# EAGLE design mercedes_shield_v2_gp (EAGLE 5.11)
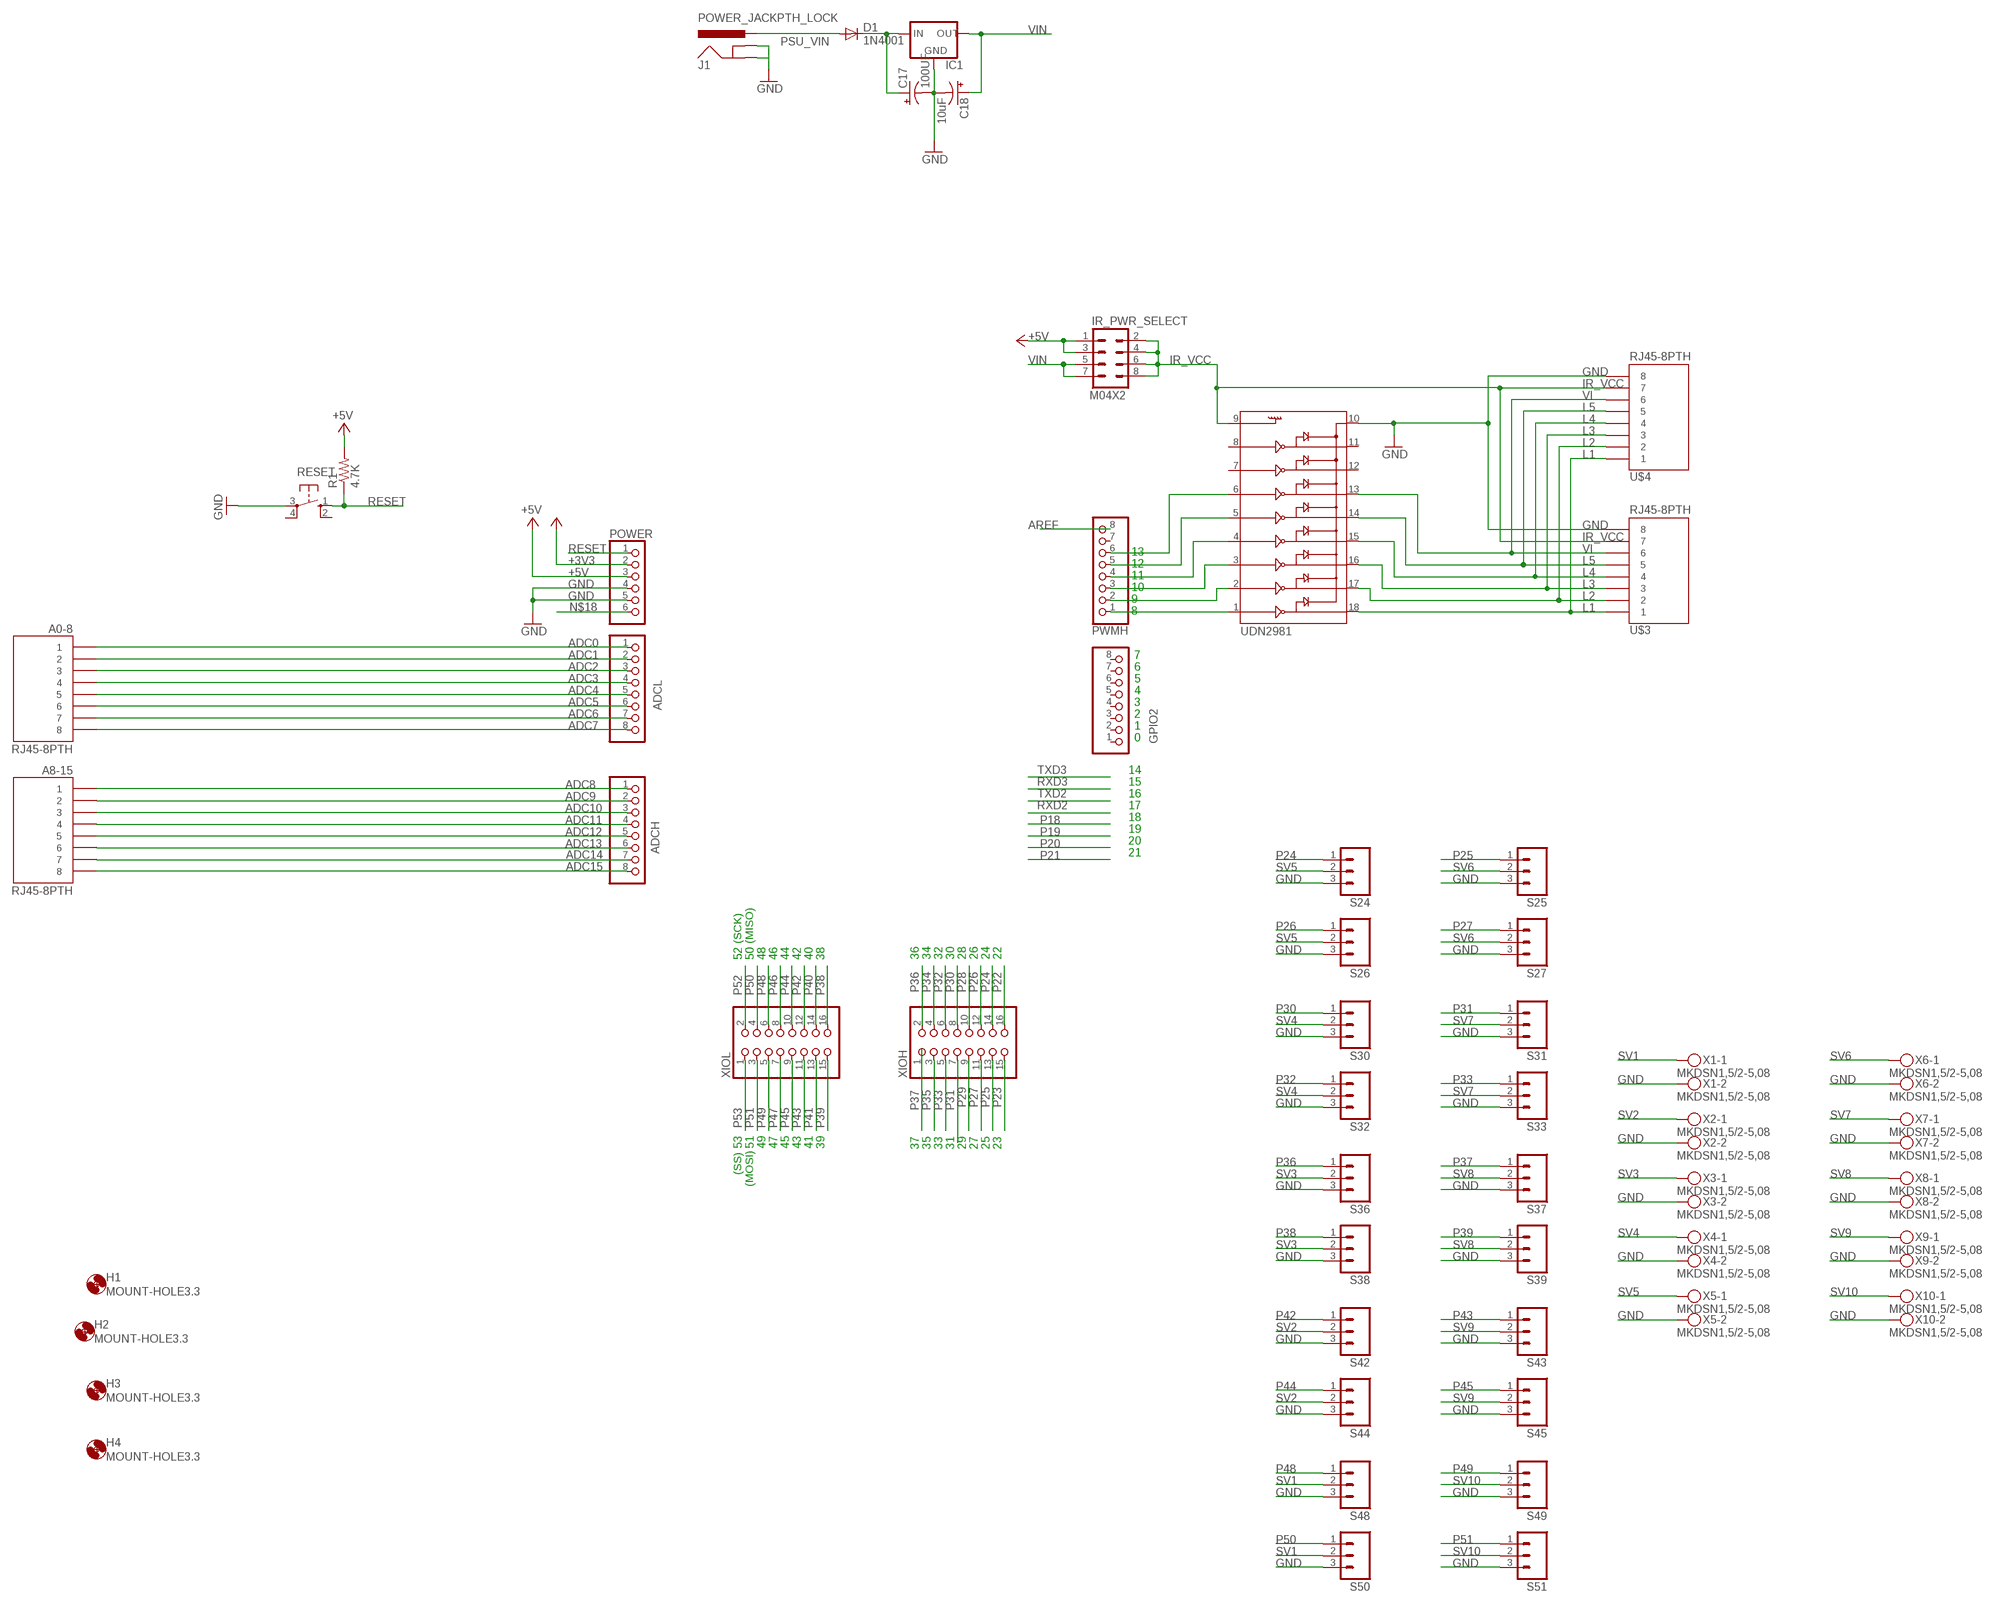
[diagram p0: schematic, sheet 1]

## Parts
A0-8  RJ45-8PTH  [RJ45-8]
A8-15  RJ45-8PTH  [RJ45-8]
ADCH  PINHD-1X8  [1X08]
ADCL  PINHD-1X8  [1X08]
C17  100UF  CAP_POLPTH1  [CPOL-RADIAL-100UF-25V]
C18  10uF  CAP_POLPTH2  [CPOL-RADIAL-10UF-25V]
D1  1N4001  DIODESMA  [SMA-DIODE]
GPIO2  PINHD-1X8  [1X08]
H1  MOUNT-HOLE3.3  [3,3]
H2  MOUNT-HOLE3.3  [3,3]
H3  MOUNT-HOLE3.3  [3,3]
H4  MOUNT-HOLE3.3  [3,3]
IC1  V_REG_78XXSINK  [TO220-IGO]
IR_PWR_SELECT  M04X2  [2X4]
J1  POWER_JACKPTH_LOCK  [POWER_JACK_PTH_LOCK]
POWER  PINHD-1X6  [1X06]
PWMH  PINHD-1X8  [1X08]
R1  4.7K  RESISTORPTH-1/4W  [AXIAL-0.4]
RESET  10-XX  [B3F-10XX]
S24  M03PTH  [1X03]
S25  M03PTH  [1X03]
S26  M03PTH  [1X03]
S27  M03PTH  [1X03]
S30  M03PTH  [1X03]
S31  M03PTH  [1X03]
S32  M03PTH  [1X03]
S33  M03PTH  [1X03]
S36  M03PTH  [1X03]
S37  M03PTH  [1X03]
S38  M03PTH  [1X03]
S39  M03PTH  [1X03]
S42  M03PTH  [1X03]
S43  M03PTH  [1X03]
S44  M03PTH  [1X03]
S45  M03PTH  [1X03]
S48  M03PTH  [1X03]
S49  M03PTH  [1X03]
S50  M03PTH  [1X03]
S51  M03PTH  [1X03]
U$3  RJ45-8PTH  [RJ45-8]
U$4  RJ45-8PTH  [RJ45-8]
UDN2981  ULN2803DIP  [DIL18]
X1  MKDSN1,5/2-5,08  [MKDSN1,5/2-5,08]
X2  MKDSN1,5/2-5,08  [MKDSN1,5/2-5,08]
X3  MKDSN1,5/2-5,08  [MKDSN1,5/2-5,08]
X4  MKDSN1,5/2-5,08  [MKDSN1,5/2-5,08]
X5  MKDSN1,5/2-5,08  [MKDSN1,5/2-5,08]
X6  MKDSN1,5/2-5,08  [MKDSN1,5/2-5,08]
X7  MKDSN1,5/2-5,08  [MKDSN1,5/2-5,08]
X8  MKDSN1,5/2-5,08  [MKDSN1,5/2-5,08]
X9  MKDSN1,5/2-5,08  [MKDSN1,5/2-5,08]
X10  MKDSN1,5/2-5,08  [MKDSN1,5/2-5,08]
XIOH  PINHD-2X8  [2X08]
XIOL  PINHD-2X8  [2X08]

## Nets
+3V3: POWER.2
+5V: IR_PWR_SELECT.1 IR_PWR_SELECT.3 POWER.3 R1.P$2
ADC0: A0-8.1 ADCL.1
ADC1: A0-8.2 ADCL.2
ADC2: A0-8.3 ADCL.3
ADC3: A0-8.4 ADCL.4
ADC4: A0-8.5 ADCL.5
ADC5: A0-8.6 ADCL.6
ADC6: A0-8.7 ADCL.7
ADC7: A0-8.8 ADCL.8
ADC8: A8-15.1 ADCH.1
ADC9: A8-15.2 ADCH.2
ADC10: A8-15.3 ADCH.3
ADC11: A8-15.4 ADCH.4
ADC12: A8-15.5 ADCH.5
ADC13: A8-15.6 ADCH.6
ADC14: A8-15.7 ADCH.7
ADC15: A8-15.8 ADCH.8
AREF: PWMH.8
GND: C17.2(-) C18.2(-) IC1.GND J1.GND J1.GNDBREAK POWER.4 POWER.5 RESET.3(P) S24.3 S25.3 S26.3 S27.3 S30.3 S31.3 S32.3 S33.3 S36.3 S37.3 S38.3 S39.3 S42.3 S43.3 S44.3 S45.3 S48.3 S49.3 S50.3 S51.3 U$3.8 U$4.8 UDN2981.10 X1.2 X2.2 X3.2 X4.2 X5.2 X6.2 X7.2 X8.2 X9.2 X10.2
IR_VCC: IR_PWR_SELECT.2 IR_PWR_SELECT.4 IR_PWR_SELECT.6 IR_PWR_SELECT.8 U$3.7 U$4.7 UDN2981.9
L1: U$3.1 U$4.1 UDN2981.18
L2: U$3.2 U$4.2 UDN2981.17
L3: U$3.3 U$4.3 UDN2981.16
L4: U$3.4 U$4.4 UDN2981.15
L5: U$3.5 U$4.5 UDN2981.14
N$1: PWMH.1 UDN2981.1
N$2: PWMH.2 UDN2981.2
N$3: PWMH.3 UDN2981.3
N$4: PWMH.4 UDN2981.4
N$5: PWMH.5 UDN2981.5
N$6: PWMH.6 UDN2981.6
N$10: C17.1(+) D1.C IC1.IN
N$18: POWER.6
P22: XIOH.16
P23: XIOH.15
P24: S24.1 XIOH.14
P25: S25.1 XIOH.13
P26: S26.1 XIOH.12
P27: S27.1 XIOH.11
P28: XIOH.10
P29: XIOH.9
P30: S30.1 XIOH.8
P31: S31.1 XIOH.7
P32: S32.1 XIOH.6
P33: S33.1 XIOH.5
P34: XIOH.4
P35: XIOH.3
P36: S36.1 XIOH.2
P37: S37.1 XIOH.1
P38: S38.1 XIOL.16
P39: S39.1 XIOL.15
P40: XIOL.14
P41: XIOL.13
P42: S42.1 XIOL.12
P43: S43.1 XIOL.11
P44: S44.1 XIOL.10
P45: S45.1 XIOL.9
P46: XIOL.8
P47: XIOL.7
P48: S48.1 XIOL.6
P49: S49.1 XIOL.5
P50: S50.1 XIOL.4
P51: S51.1 XIOL.3
P52: XIOL.2
P53: XIOL.1
PSU_VIN: D1.A J1.PWR
RESET: POWER.1 R1.P$1 RESET.1(S)
SV1: S48.2 S50.2 X1.1
SV2: S42.2 S44.2 X2.1
SV3: S36.2 S38.2 X3.1
SV4: S30.2 S32.2 X4.1
SV5: S24.2 S26.2 X5.1
SV6: S25.2 S27.2 X6.1
SV7: S31.2 S33.2 X7.1
SV8: S37.2 S39.2 X8.1
SV9: S43.2 S45.2 X9.1
SV10: S49.2 S51.2 X10.1
VI: U$3.6 U$4.6 UDN2981.13
VIN: C18.1(+) IC1.OUT IR_PWR_SELECT.5 IR_PWR_SELECT.7
Unconnected: GPIO2.1 GPIO2.2 GPIO2.3 GPIO2.4 GPIO2.5 GPIO2.6 GPIO2.7 GPIO2.8 PWMH.7 RESET.2(S1) RESET.4(P1) UDN2981.7 UDN2981.8 UDN2981.11 UDN2981.12

## Notes on the sheet
- 13
- 12
- 11
- 10
- 9
- 8
- 7
- 6
- 5
- 4
- 3
- 2
- 1
- 0
- 14
- 15
- 16
- 17
- 18
- 19
- 20
- 21
- (SCK) | (MISO)
- 52 | 50 | 48 | 46 | 44 | 42 | 40 | 38 | 36 | 34 | 32 | 30 | 28 | 26 | 24 | 22
- 53 | 51 | 49 | 47 | 45 | 43 | 41 | 39 | 37 | 35 | 33 | 31 | 29 | 27 | 25 | 23
- (SS)
- (MOSI)

## Library data of the parts
A0-8 A8-15 U$3 U$4 = SparkFun:RJ45-8: RJ45 Jack Simple RJ45, 8-pin connection - connector for common Cat5, Cat5e, and Cat6 Ethernet cables. Footprint not yet proven in production. Connector sku is PRT-00643; Breakout PCB sku is BOB-00716.
ADCH ADCL GPIO2 PWMH = pinhead:PINHD-1X8: PIN HEADER
C17 C18 = SparkFun:CAP_POL: Capacitor Polarized These are standard SMD and PTH capacitors. Normally 10uF, 47uF, and 100uF in electrolytic and tantalum varieties. Always verify the external diameter of the through hole cap, it varies with capacity, voltage, and manufacturer. The EIA devices should be standard.
D1 = SparkFun:DIODE: Diode These are standard reverse protection diodes and small signal diodes. SMA package can handle up to about 1A. SOD-323 can handle about 200mA. What the SOD-323 package when ordering, there are some mfgs out there that are 5-pin packages.
H1-H4 = holes:MOUNT-HOLE: MOUNTING HOLE with drill center marker
IC1 = SparkFun:V_REG_78XX: Voltage Regulator Standard 7805 5V regulator. IGO (Input Ground Output). Spark Fun Electronics SKU : COM-00107
IR_PWR_SELECT = SparkFun:M04X2
J1 = SparkFun:POWER_JACK: Power Jack This is the standard 5.5mm barrel jack for power. The PTH is the most common, proven, reliable, footprint. All others are experimental. The Slot footprint only works if the mill layer is transmitted to the PCB fab house so be warned. Spark Fun Electronics SKU : PRT-00119. Mating wall wart : TOL-00298 (and others)
POWER = pinhead:PINHD-1X6: PIN HEADER
R1 = SparkFun:RESISTOR: Resistor Basic schematic elements and footprints for 0603, 1206, and PTH resistors.
RESET = switch-omron:10-XX: OMRON SWITCH; MPN: B3F-1000; OC_FARNELL: 176432; OC_NEWARK: 36M3542
S24-S27 S30-S33 S36-S39 S42-S45 S48-S51 = SparkFun:M03: Header 3 Standard 3-pin 0.1" header. Use with straight break away headers (SKU : PRT-00116), right angle break away headers (PRT-00553), swiss pins (PRT-00743), machine pins (PRT-00117), and female headers (PRT-00115). Molex polarized connector foot print use with SKU : PRT-08232 with associated crimp pins and housings.
UDN2981 = SparkFun:ULN2803: Darlington Driver ULN2803 Darlington array. 500mA max per channel, 8-channel package. Spark Fun Electronics SKU : COM-00312
X1-X10 = con-phoenix-508:MKDSN1,5/2-5,08: MKDSN 1,5/ 2-5,08 Printklemme Nennstrom: 13,5 A Nennspannung: 250 V Rastermaß: 5,08 mm Polzahl: 2 Anschlussart: Schraubanschluss Montage: Löten Anschlussrichtung Leiter/Platine: 0 ° Artikelnummer: 1729128 Source: http://eshop.phoenixcontact.com .. 1729128.pdf; MPN: MKDSN 1,5/2-5.08; OC_FARNELL: 1792903; OC_NEWARK: 30M2397
XIOH XIOL = pinhead:PINHD-2X8: PIN HEADER

## Net classes
0 default: width 0.152 mm, drill 0.305 mm, clearance 0.152 mm

## Board
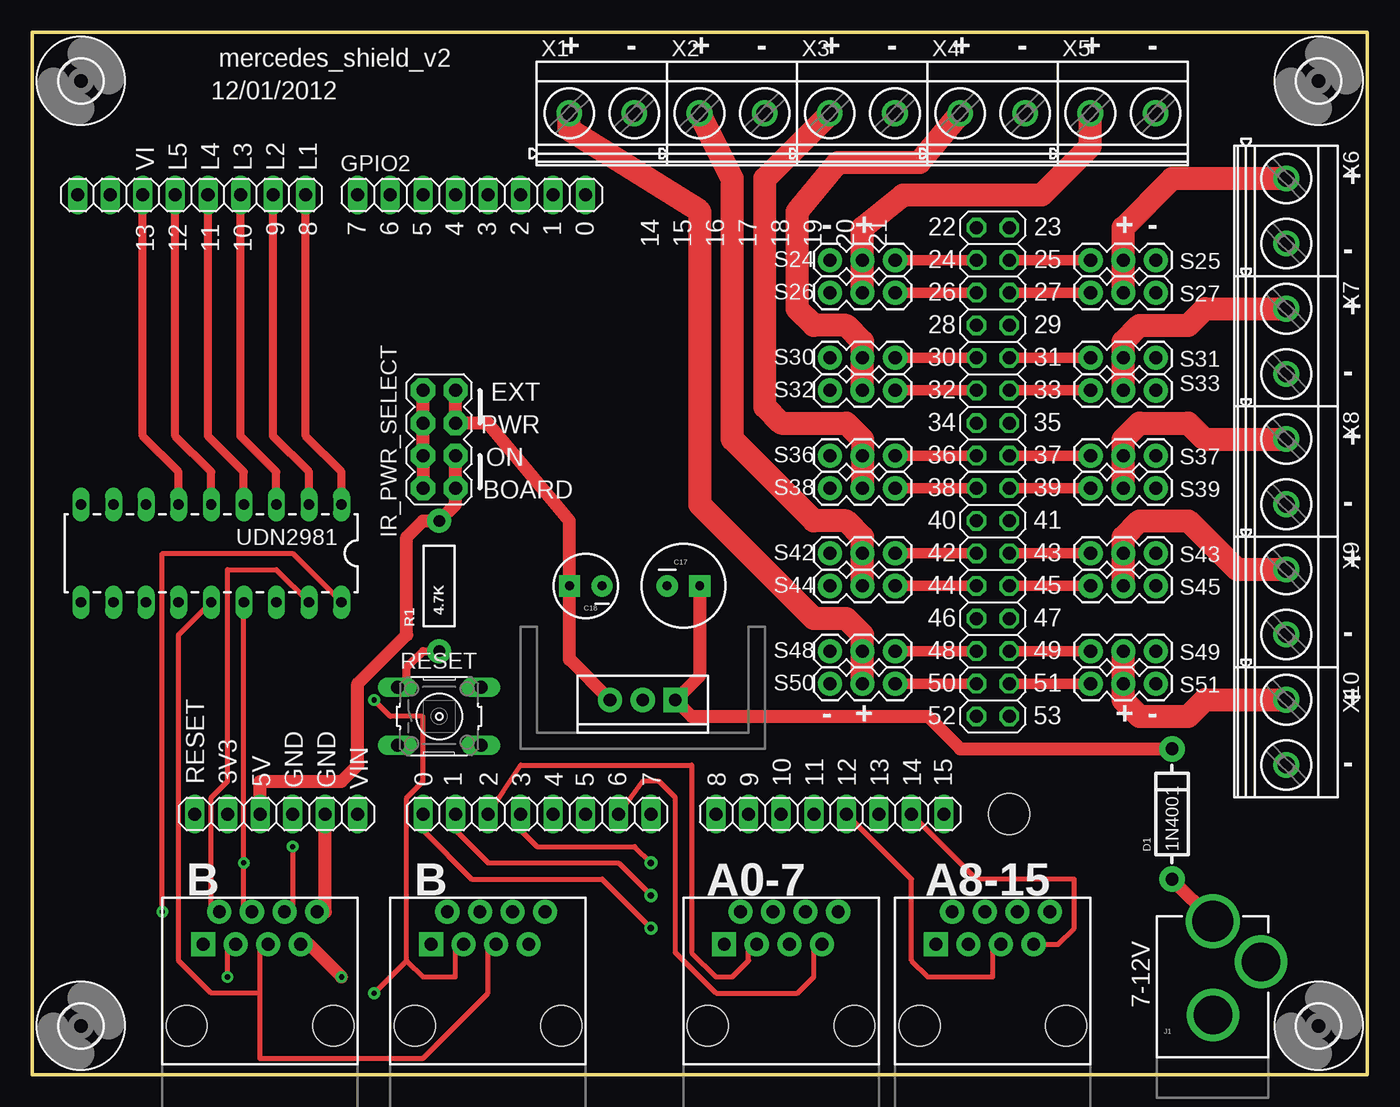
[diagram p1: board, top side]
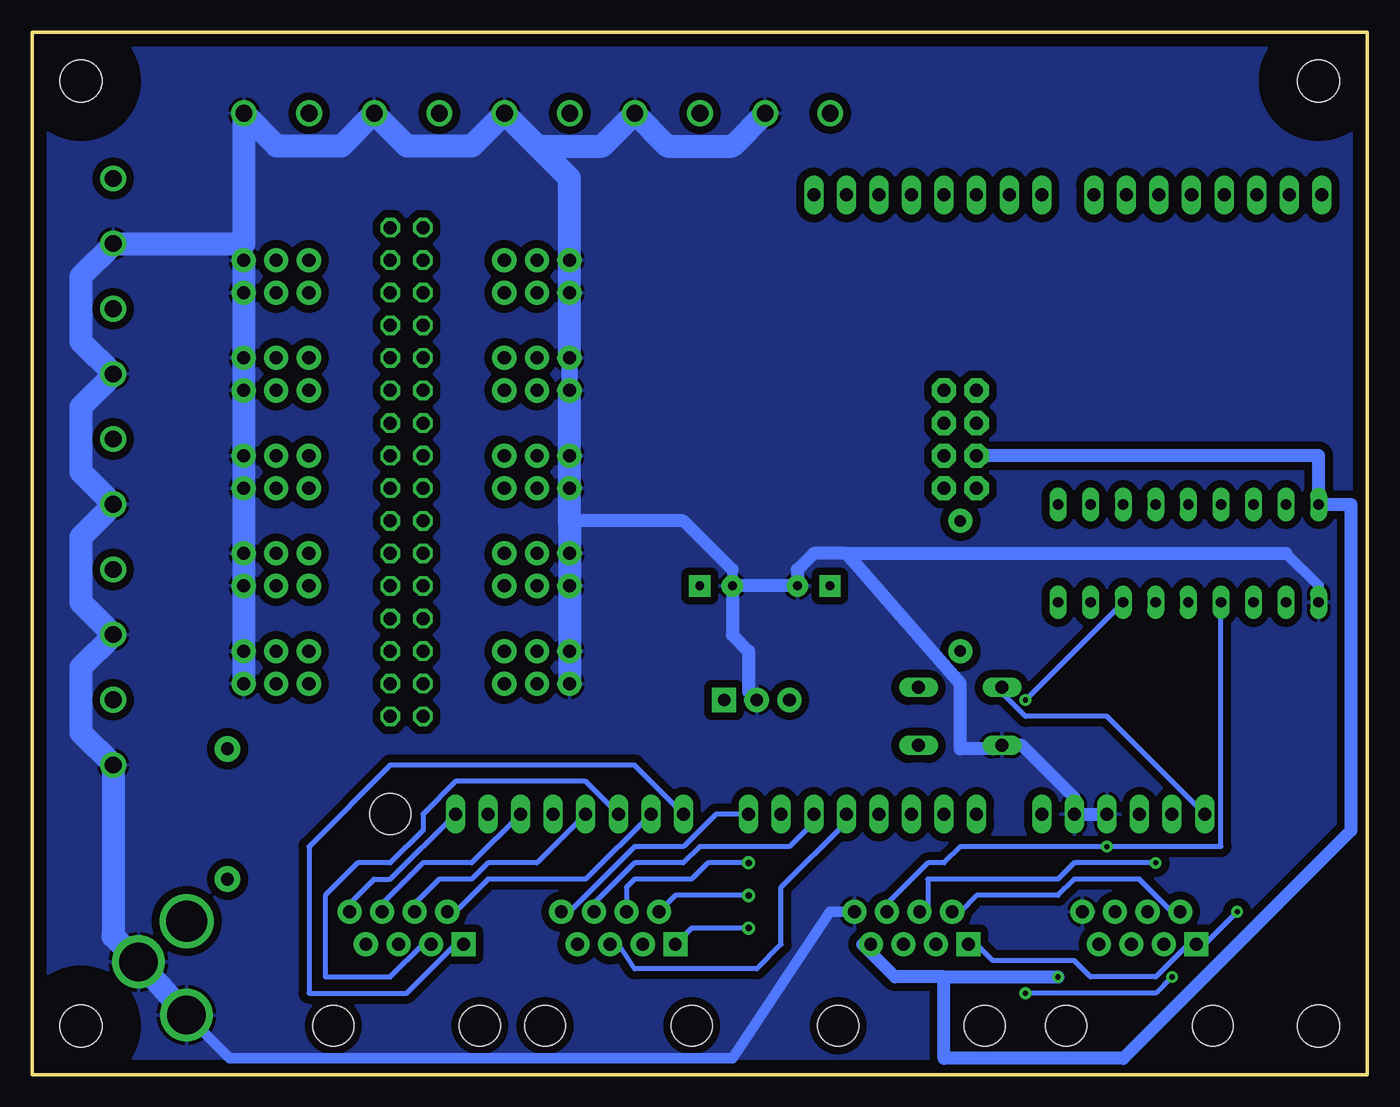
[diagram p2: board, bottom side, seen from below]

Size 104.14 x 81.28 mm. Coordinates in mm from the lower left corner, seen from the top.
Outline: 0,81.28 104.14,81.28 104.14,0 0,0 0,81.28
Copper layers (1*16): Top 0.035mm / dielectric 1.5mm / Bottom 0.035mm
Design rules "pcbtrain *": minimum track width 0.4mm, minimum drill 0.4mm, track to track 0.2mm, track to pad 0.2mm, pad to pad 0.2mm, via to via 0.2mm, smd to smd 0mil, copper to edge 10mil, drill to drill 0.2mm, minimum pad ring 10mil, minimum via ring 10mil, stop-mask expansion 0.125mm, vias tented up to drill 0mil, thermal gap 10mil
Holes 3.2 mm at 76.2,20.32

### Footprints (pad centres in the part's own frame; a part is rotated, then mirrored left to right if it is on the bottom)
RJ45-8 = drill 1 pad 1.88 square: 1 -4.445,6.35 | drill 1 pad 1.88 round: 2 -3.175,8.89; 3 -1.905,6.35; 4 -0.635,8.89; 5 0.635,6.35; 6 1.905,8.89; 7 3.175,6.35; 8 4.445,8.89 | hole 3.2: -5.715,0; 5.715,0
1X08 = drill 1.016 long: 1 -8.89,0; 2 -6.35,0; 3 -3.81,0; 4 -1.27,0; 5 1.27,0; 6 3.81,0; 7 6.35,0; 8 8.89,0
CPOL-RADIAL-100UF-25V = drill 0.7 pad 1.651 square: 1 1.27,0 | drill 0.7 pad 1.651 round: 2 -1.27,0
CPOL-RADIAL-10UF-25V = drill 0.7 pad 1.651 square: 1 1.27,0 | drill 0.7 pad 1.651 round: 2 -1.27,0
DIODE-1N4001 = drill 1 pad 1.981 round: A -5.08,0; C 5.08,0
3,3 = hole 3.3: 0,0
TO220-IGO = drill 1 pad 1.88 round: GND 0,0; OUT 2.54,0 | drill 1 pad 1.88 square: IN -2.54,0
2X4 = drill 1.016 pad 1.88 octagon: 1 -3.81,-1.27; 2 -3.81,1.27; 3 -1.27,-1.27; 4 -1.27,1.27; 5 1.27,-1.27; 6 1.27,1.27; 7 3.81,-1.27; 8 3.81,1.27
POWER_JACK_PTH_LOCK = drill 2.997 pad 4.115 round: GND 0.025,6.557; GNDBREAK 3.762,10.7 | drill 3.2 pad 4.115 round: PWR 0,13.878
1X06 = drill 1.016 long: 1 -6.35,0; 2 -3.81,0; 3 -1.27,0; 4 1.27,0; 5 3.81,0; 6 6.35,0
AXIAL-0.4 = drill 0.9 pad 1.88 round: P$1 -5.08,0; P$2 5.08,0
B3F-10XX = drill 1.016 long: 1 -3.251,2.261; 2 3.251,2.261; 3 -3.251,-2.261; 4 3.251,-2.261
1X03 = drill 1.016 pad 1.88 round: 1 0,0; 2 2.54,0; 3 5.08,0
DIL18 = drill 0.813 long: 1 -10.16,-3.81; 2 -7.62,-3.81; 3 -5.08,-3.81; 4 -2.54,-3.81; 5 0,-3.81; 6 2.54,-3.81; 7 5.08,-3.81; 8 7.62,-3.81; 9 10.16,-3.81; 10 10.16,3.81; 11 7.62,3.81; 12 5.08,3.81; 13 2.54,3.81; 14 0,3.81; 15 -2.54,3.81; 16 -5.08,3.81; 17 -7.62,3.81; 18 -10.16,3.81
MKDSN1,5/2-5,08 = drill 1.3 pad 2 round: 1 -2.561,0.025; 2 2.519,0.025
2X08 = drill 1.016 octagon: 1 -8.89,-1.27; 2 -8.89,1.27; 3 -6.35,-1.27; 4 -6.35,1.27; 5 -3.81,-1.27; 6 -3.81,1.27; 7 -1.27,-1.27; 8 -1.27,1.27; 9 1.27,-1.27; 10 1.27,1.27; 11 3.81,-1.27; 12 3.81,1.27; 13 6.35,-1.27; 14 6.35,1.27; 15 8.89,-1.27; 16 8.89,1.27

### Placement (x,y rotation side)
A0-8  58.42,3.81 0 top
A8-15  74.93,3.81 0 top
ADCH  62.23,20.32 0 top
ADCL  39.37,20.32 0 top
C17  50.8,38.1 0 top
C18  43.18,38.1 180 top
D1  1N4001  [DIODE-1N4001]  88.9,20.32 90 top
GPIO2  34.29,68.58 0 top
H1  3.81,77.47 0 top
H2  100.33,77.47 0 top
H3  100.33,3.81 0 top
H4  3.81,3.81 0 top
IC1  47.62,29.21 180 top
IR_PWR_SELECT  31.75,49.53 90 top
J1  92.08,-1.91 0 top
POWER  19.05,20.32 0 top
PWMH  12.45,68.58 180 top
R1  31.75,38.1 90 top
RESET  31.75,27.94 0 top
S24  67.31,63.5 180 top
S25  82.55,63.5 0 top
S26  67.31,60.96 180 top
S27  82.55,60.96 0 top
S30  67.31,55.88 180 top
S31  82.55,55.88 0 top
S32  67.31,53.34 180 top
S33  82.55,53.34 0 top
S36  67.31,48.26 180 top
S37  82.55,48.26 0 top
S38  67.31,45.72 180 top
S39  82.55,45.72 0 top
S42  67.31,40.64 180 top
S43  82.55,40.64 0 top
S44  67.31,38.1 180 top
S45  82.55,38.1 0 top
S48  67.31,33.02 180 top
S49  82.55,33.02 0 top
S50  67.31,30.48 180 top
S51  82.55,30.48 0 top
U$3  35.56,3.81 0 top
U$4  17.78,3.81 0 top
UDN2981  13.97,40.64 180 top
X1  44.45,74.93 0 top
X2  54.61,74.93 0 top
X3  64.77,74.93 0 top
X4  74.93,74.93 0 top
X5  85.09,74.93 0 top
X6  97.79,67.31 270 top
X7  97.79,57.15 270 top
X8  97.79,46.99 270 top
X9  97.79,36.83 270 top
X10  97.79,26.67 270 top
XIOH  74.93,57.15 90 top
XIOL  74.93,36.83 90 top

### Tracks (layer width: path | path; a pad name or v marks a point on that pad's centre or on a via)
+5V
  Top 1.016: IR_PWR_SELECT.3 IR_PWR_SELECT.1 33.02,44.45 R1.P$2 30.48,43.18 29.21,41.91 29.21,34.29 25.4,30.48 25.4,24.13 24.13,22.86 17.78,22.86 POWER.3
ADC0  (via drill 0.51)
  Top 0.406: ADCL.1 30.48,19.05 34.29,15.24 44.45,15.24 v48.26,11.43
  Bottom 0.406: v48.26,11.43 52.71,11.43 A0-8.1
ADC1  (via drill 0.51)
  Top 0.406: ADCL.2 33.02,19.05 35.56,16.51 45.72,16.51 v48.26,13.97
  Bottom 0.406: v48.26,13.97 53.98,13.97 A0-8.2
ADC2
  Top 0.4: ADCL.3 38.1,24.13 51.44,24.13 51.44,9.53 53.34,7.62 54.61,7.62 55.88,8.89 55.88,10.16 A0-8.3
ADC3  (via drill 0.51)
  Top 0.406: ADCL.4 38.1,19.05 39.37,17.78 46.99,17.78 v48.26,16.51
  Bottom 0.406: A0-8.4 57.79,14.61 57.15,15.24 52.71,15.24 51.44,16.51 v48.26,16.51
ADC4
  Bottom 0.4: ADCL.5 40.64,19.68 45.72,14.61 45.72,10.16 47.62,8.26 57.15,8.26 58.42,10.16 A0-8.5
ADC5
  Bottom 0.4: ADCL.6 43.18,19.68 45.09,17.78 52.07,17.78 53.34,16.51 57.15,16.51 60.96,12.7 A0-8.6
ADC6
  Top 0.4: ADCL.7 47.62,22.86 48.9,22.86 50.17,21.59 50.17,9.53 53.34,6.35 59.69,6.35 60.96,7.62 60.96,10.16 A0-8.7
ADC7
  Bottom 0.406: ADCL.8 50.8,20.32 53.34,17.78 57.15,17.78 62.23,12.7 A0-8.8
ADC8
  Bottom 0.4: ADCH.1 57.15,24.13 76.2,24.13 82.55,17.78 82.55,6.35 74.93,6.35 71.12,10.16 A8-15.1
ADC9
  Bottom 0.4: ADCH.2 60.96,15.24 68.58,15.24 71.12,12.7 A8-15.2
ADC10
  Bottom 0.4: ADCH.3 60.96,22.86 71.12,22.86 73.66,20.32 73.66,19.05 76.2,16.51 78.74,16.51 81.28,13.97 81.28,7.62 76.2,7.62 73.66,10.16 A8-15.3
ADC11
  Bottom 0.4: ADCH.4 64.77,16.51 68.58,16.51 69.85,15.24 72.39,15.24 74.93,12.7 A8-15.4
ADC12
  Top 0.4: ADCH.5 68.58,15.24 68.58,8.89 69.85,7.62 74.93,7.62 74.93,10.16 A8-15.5
ADC13
  Bottom 0.4: ADCH.6 69.85,16.51 73.66,16.51 77.47,12.7 A8-15.6
ADC14
  Top 0.4: ADCH.7 73.66,15.24 81.28,15.24 81.28,11.43 80.01,10.16 A8-15.7
ADC15
  Bottom 0.4: ADCH.8 76.2,15.24 77.47,15.24 80.01,12.7 A8-15.8
GND
  Top 1.016: POWER.5 22.86,12.7 U$4.8
  Bottom 0.813: C17.2 49.53,39.37 | 48.26,29.84 IC1.GND | U$3.8 41.91,12.7 49.53,1.27 88.72,1.27 J1.GND | UDN2981.10 3.81,38.1 6.35,40.64 | RESET.3 29.21,25.4
  Bottom 1.016: POWER.4 POWER.5 22.86,21.59 26.95,25.68 RESET.3 | 49.53,39.37 53.34,43.18 62.23,43.18 | 48.26,29.84 48.26,33.02 49.53,34.29 C17.2 C18.2 44.45,39.37 43.18,40.64 40.64,40.64 | 40.64,40.64 6.35,40.64 | 29.21,25.4 31.75,25.4 31.75,30.48 40.64,40.64
  Bottom 1.27: S32.3 S30.3 | S25.3 87.63,64.77 87.66,64.75 | X5.2 87.63,74.93 | 97.81,64.75 X6.2 | X7.2 97.81,54.59 | X8.2 97.81,44.42 | X9.2 97.81,34.27 | X1.2 | 54.61,72.44 54.61,72.39 | X2.2 | X3.2 | 74.93,72.39 74.93,72.44 | X4.2 | 85.09,72.39 85.09,72.44 | J1.GNDBREAK 95.91,8.87
  Bottom 1.778: S50.3 S48.3 S44.3 S42.3 62.23,43.18 S38.3 S36.3 S32.3 | S30.3 S26.3 S24.3 62.23,69.9 64.72,72.39 | S51.3 S49.3 S45.3 S43.3 S39.3 S37.3 S33.3 S31.3 S27.3 S25.3 | 87.63,74.93 87.63,64.77 | X7.2 100.33,57.15 100.33,62.23 97.81,64.75 87.66,64.75 | 97.81,54.59 100.33,52.07 100.33,46.99 X8.2 | 97.81,44.42 100.33,41.91 100.33,36.83 X9.2 | 97.81,34.27 100.33,31.75 100.33,26.67 X10.2 97.81,10.77 J1.GNDBREAK | X1.2 49.53,72.39 54.61,72.39 | X2.2 54.61,72.44 | X2.2 59.69,72.39 64.72,72.39 | 64.72,72.39 X3.2 | X3.2 69.85,72.39 74.93,72.39 | 74.93,72.44 X4.2 | X4.2 80.01,72.39 85.09,72.39 | 85.09,72.44 X5.2 | 95.91,8.87 J1.GND
  pour Bottom (isolate 0.61): 1.27,80.01 102.87,80.01 102.87,1.27 1.27,1.27
IR_VCC  (via drill 0.4)
  Top 1.016: IR_PWR_SELECT.8 IR_PWR_SELECT.6 IR_PWR_SELECT.4 IR_PWR_SELECT.2 | v24.13,7.62 21.59,10.16 U$4.7
  Bottom 1.016: IR_PWR_SELECT.4 3.81,48.26 UDN2981.9 1.27,44.45 1.27,19.05 19.05,1.27 33.02,1.27 33.02,7.62 | 33.02,7.62 36.83,7.62 39.37,10.16 U$3.7 | 33.02,7.62 v24.13,7.62
L1  (via drill 0.4)
  Top 0.4: UDN2981.18 20.32,40.64 10.16,40.64 v10.16,12.7
  Bottom 0.4: v10.16,12.7 12.7,10.16 U$4.1 13.97,10.16 16.51,7.62 21.59,7.62 22.86,8.89 29.21,8.89 30.48,10.16 U$3.1
L2
  Top 0.4: UDN2981.17 19.05,39.37 15.24,39.37 15.24,22.86 13.97,21.59 13.97,12.7 U$4.2
  Bottom 0.4: U$3.2 31.75,12.7 30.48,13.97 24.13,13.97 22.86,15.24 17.78,15.24 15.24,12.7 U$4.2
L3  (via drill 0.4)
  Top 0.4: v26.67,29.21 27.94,27.94 30.48,27.94 30.48,22.86 29.21,21.59 29.21,8.89 | 29.21,8.89 30.48,7.62 33.02,7.62 33.02,10.16 U$3.3 | v15.24,7.62 15.24,10.16 U$4.3 | v26.67,6.35 29.21,8.89
  Bottom 0.4: v26.67,29.21 UDN2981.16 | v15.24,7.62 16.51,6.35 v26.67,6.35
L4  (via drill 0.4)
  Top 0.4: UDN2981.15 v16.51,16.51 16.51,12.7 U$4.4
  Bottom 0.4: v16.51,16.51 22.86,16.51 24.13,15.24 34.29,15.24 34.29,12.7 U$3.4
L5
  Top 0.4: UDN2981.14 11.43,34.29 11.43,8.89 13.97,6.35 17.78,6.35 | 17.78,6.35 17.78,10.16 U$4.5 | 17.78,6.35 17.78,1.27 30.48,1.27 35.56,6.35 35.56,10.16 U$3.5
N$1
  Top 0.61: PWMH.1 21.34,49.78 24.13,46.99 UDN2981.1
N$2
  Top 0.61: PWMH.2 18.8,49.78 21.59,46.99 UDN2981.2
N$3
  Top 0.61: PWMH.3 16.26,49.78 19.05,46.99 UDN2981.3
N$4
  Top 0.61: PWMH.4 13.72,49.78 16.51,46.99 UDN2981.4
N$5
  Top 0.61: PWMH.5 11.18,49.78 13.97,46.99 UDN2981.5
N$6
  Top 0.61: PWMH.6 8.64,49.78 11.43,46.99 UDN2981.6
N$10
  Top 1.016: D1.C 72.39,25.4 69.85,27.94 51.44,27.94 IC1.IN 52.07,31.11 C17.1
P24
  Top 0.813: S24.1 XIOH.14
P25
  Top 0.813: XIOH.13 S25.1
P26
  Top 0.813: S26.1 XIOH.12
P27
  Top 0.813: XIOH.11 S27.1
P30
  Top 0.813: S30.1 XIOH.8
P31
  Top 0.813: XIOH.7 S31.1
P32
  Top 0.813: S32.1 XIOH.6
P33
  Top 0.813: XIOH.5 S33.1
P36
  Top 0.813: S36.1 XIOH.2
P37
  Top 0.813: XIOH.1 S37.1
P38
  Top 0.813: S38.1 XIOL.16
P39
  Top 0.813: XIOL.15 S39.1
P42
  Top 0.813: S42.1 XIOL.12
P43
  Top 0.813: XIOL.11 S43.1
P44
  Top 0.813: S44.1 XIOL.10
P45
  Top 0.813: XIOL.9 S45.1
P48
  Top 0.813: S48.1 XIOL.6
P49
  Top 0.813: XIOL.5 S49.1
P50
  Top 0.813: S50.1 XIOL.4
P51
  Top 0.813: XIOL.3 S51.1
PSU_VIN
  Top 0.813: J1.PWR 92.08,12.06
  Top 1.016: 92.08,12.06 D1.A
RESET
  Top 0.61: R1.P$1 30.48,33.02 29.21,31.75 29.21,30.91 RESET.1
  Bottom 0.4: POWER.1 20.32,27.94 26.67,27.94 29.21,30.48 RESET.1
SV1
  Top 1.778: X1.1 41.89,73.68 52.07,67.31 52.07,44.45 60.96,35.56 63.5,35.56 64.77,34.29 S48.2 S50.2
SV2
  Top 1.778: X2.1 54.61,69.85 54.61,49.53 60.96,43.18 63.5,43.18 64.77,41.91 S42.2 S44.2
SV3
  Top 1.778: X3.1 62.21,74.91 57.15,69.85 57.15,52.07 58.42,50.8 63.5,50.8 64.77,49.53 S36.2 S38.2
SV4
  Top 0.813: 72.37,74.91 X4.1
  Top 1.778: 72.37,74.91 69.21,71.12 62.87,71.12 59.69,67.31 59.69,59.69 60.96,58.42 63.5,58.42 64.77,57.15 S30.2 S32.2
SV5
  Top 1.778: X5.1 82.53,72.37 78.74,68.58 67.94,68.58 64.77,66.04 S24.2 S26.2
SV6
  Top 1.778: X6.1 88.92,69.87 85.09,66.04 S25.2 S27.2
SV7
  Top 1.778: X7.1 91.46,59.71 90.17,58.42 86.36,58.42 85.09,57.15 S31.2 S33.2
SV8
  Top 1.778: X8.1 91.42,49.55 90.17,50.8 86.36,50.8 85.09,49.53 S37.2 S39.2
SV9
  Top 1.778: X9.1 93.96,39.39 90.17,43.18 86.36,43.18 85.09,41.91 S43.2 S45.2
SV10
  Top 1.778: X10.1 91.46,29.23 90.17,27.94 86.36,27.94 85.09,29.21 S51.2 S49.2
VI  (via drill 0.4)
  Top 0.4: v20.32,17.78 20.32,12.7 U$4.6
  Bottom 0.4: UDN2981.13 11.43,17.78 v20.32,17.78 31.75,17.78 33.02,16.51 34.29,16.51 38.1,12.7 U$3.6
VIN
  Top 1.016: IR_PWR_SELECT.7 IR_PWR_SELECT.5 35.56,50.8 41.91,43.18 C18.1 41.91,32.38 IC1.OUT

### Text on the board
tPlace: mercedes_shield_v2 | + | - | + | - | + | - | + | - | + | - | 12/01/2012 | VI | L5 | L4 | L3 | L2 | L1 | + | 9 | 8 | 7 | 6 | 5 | 4 | 3 | 2 | 1 | 0 | - | - | + | 22 | 23 | + | - | 13 | 12 | 11 | 10 | - | 24 | 25 | 26 | 27 | + | 28 | 29 | 30 | 31 | EXT | - | 32 | 33 | PWR | 34 | 35 | ON | + | 36 | 37 | BOARD | 38 | 39 | - | 40 | 41 | 42 | 43 | + | 44 | 45 | 46 | 47 | - | 48 | 49 | 50 | 51 | + | - | + | 52 | 53 | + | - | RESET | 3V3 | - | 5V | GND | GND | VIN | 0 | 1 | 2 | 3 | 4 | 5 | 6 | 7 | 8 | 9 | 10 | 11 | 12 | 13 | 14 | 15 | B | B | A0-7 | A8-15 | 7-12V
tNames: 14 | 15 | 16 | 17 | 18 | 19 | 20 | 21
ReferenceLC: L | TX | RX | PC1 | PC2